# EAGLE schematic DC-DC converter (EAGLE 9.6.2)
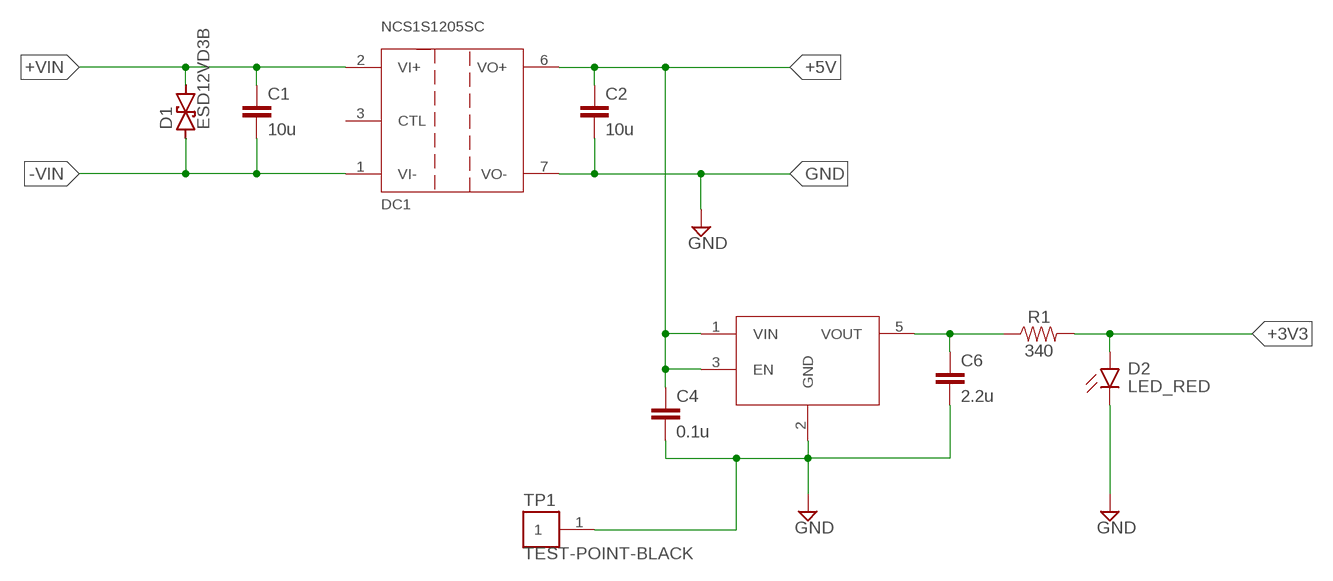
[diagram p0: schematic, sheet 1]

## Parts
C1  10u  CAP-10UF-10%-16V-X7R-1206IPC  [1206]
C2  10u  CAP-10UF-10%-16V-X7R-1206IPC  [1206]
C4  0.1u  CAP-0.1UF-0603-25V-X8R  [C0603]
C6  2.2u  CAP-2.2UF-10%-6.3V-X7R-0603IPC  [0603]
D1  ESD12VD3B  [SOD23]
D2  LED_RED  CHIP-FLAT-R_0805  [LEDC2012X110N_FLAT-R]
DC1  NCS1S1205SC  [7-SIP]
DC2  NCV551SN33T1G  [SOT23-5]
R1  340  RES-340OHM-0603-1/10W-1%  [R0603]
TP1  TEST-POINT-BLACK  [KEYSTONE_5001_0]

## Nets
+3V3: D2.A R1.2
+5V: C2.1 C4.1 DC1.6(VO+) DC2.1(VIN) DC2.3(EN)
+VIN: C1.1 D1.2 DC1.2(VI+)
-VIN: C1.2 D1.1 DC1.1(VI-)
GND: C2.2 C4.2 C6.2 D2.C DC1.7(VO-) DC2.2(GND) TP1.1
N$3: C6.1 DC2.5(VOUT) R1.1
Unconnected: DC1.3(CTL)

## Library data of the parts
C1 C2 = gtsr-passive:CAP-10UF: 10µF Ceramic Capacitor; MFR: Murata Electronics; MPN: GCM31CR71C106KA64K; SPN: 490-14746-1-ND; SPR: Digi-Key
C4 = gtsr-passive:CAP-0.1UF: 0.1µF Ceramic Capacitor; MANUFACTURER: Murata Electronics; MFPN: GCM188R91E104KA37D; SUPPLIER: Digi-Key; SUPPLIER_PN: 490-14359-1-ND
C6 = gtsr-passive:CAP-2.2UF: 2.2µF Ceramic Capacitor; MFR: Murata Electronics; MPN: GCM188R70J225KE22D; SPN: 490-5316-1-ND; SPR: Digi-Key
D1 = gtsr-diode:ESD12VD3B; MANUFACTURER: Micro Commercial Co; MFPN: ESD12VD3B-TP; SUPPLIER: Digikey; SUPPLIER_PN: ESD12VD3B-TPMSCT-ND
D2 = LED:CHIP-FLAT-R; CATEGORY: LED; COLOR: RED; DESCRIPTION: CHIP LED FLAT; SUB-CATEGORY: CHIP; TYPE: FLAT_TOP
DC1 = gtsr-power-supply:NCS1S1205SC: Isolated Module DC DC Converter 1 Output 5V 200mA 4.5V - 18V Input; MANUFACTURER: Murata; MFPN: NCS1S1205SC; SUPPLIER: Digikey; SUPPLIER_PN: 811-2945-ND
DC2 = gtsr-power-supply:NCV551; AUTOMOTIVE: Yes; MANUFACTURER: ON Semiconductor; MFPN: NCV551SN33T1G; SUPPLIER: Digikey; SUPPLIER_PN: NCV551SN33T1GOSCT-ND; VOUT: 3.3
R1 = gtsr-passive:RES-340OHM; MANUFACTURER: Panasonic; MFPN: ERJ-3EKF3400V; SUPPLIER: Digikey; SUPPLIER_PN: P340HCT-ND
TP1 = gtsr-connector:TEST-POINT: BLACK THRU-HOLE MOUNT TEST POINT; MANUFACTURER: Keystone Electronics; MFPN: 5001; SUPPLIER: Digikey; SUPPLIER_PN: 36-5001-ND